# EAGLE design mini1284 (EAGLE 6.4)
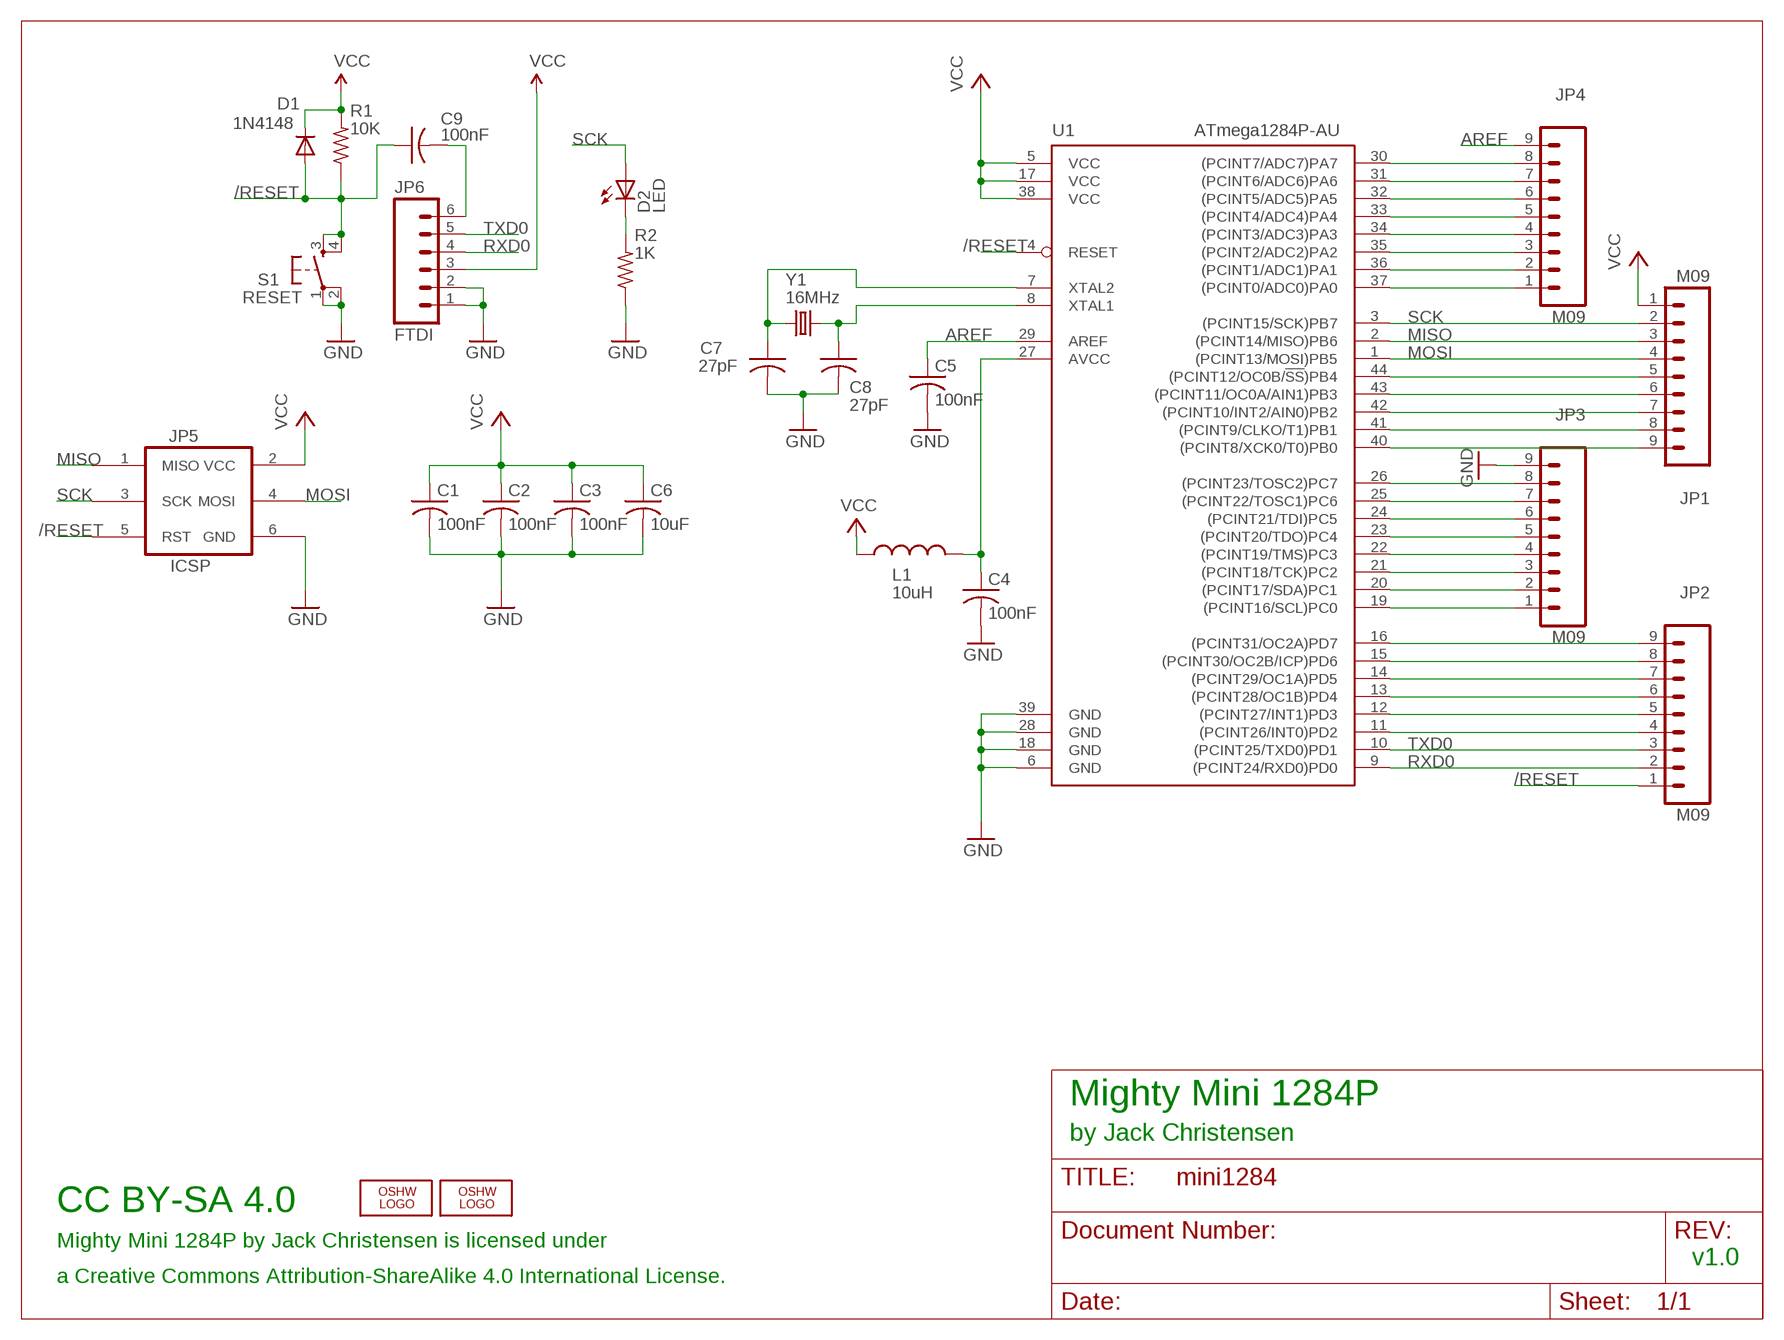
[diagram p0: schematic, sheet 1]

## Parts
C1  100nF  C-USM0805  [M0805]
C2  100nF  C-USM0805  [M0805]
C3  100nF  C-USM0805  [M0805]
C4  100nF  C-USM0805  [M0805]
C5  100nF  C-USM0805  [M0805]
C6  10uF  C-USM1206  [M1206]
C7  27pF  C-USM0805  [M0805]
C8  27pF  C-USM0805  [M0805]
C9  100nF  C-USM0805  [M0805]
D1  1N4148  DIODESOD-323F-A  [SOD-323F-A]
D2  LED  LEDD0805A  [D0805A]
JP1  M09  [1X09]
JP2  M09  [1X09]
JP3  M09  [1X09]
JP4  M09  [1X09]
JP5  ICSP  AVR_SPI_PRG_62X3_LOCK  [2X3_LOCK]
JP6  FTDI  M06LOCK  [1X06_LOCK]
L1  10uH  INDUCTORM0805  [M0805]
LOGO1  OSHW_LOGO_8MILX0150-NT  [OSHW_8X150_NOTEXT]
LOGO2  OSHW_LOGO_6MILX0100-NT  [OSHW_6X100_NOTEXT]
R1  10K  R-US_M0805  [M0805]
R2  1K  R-US_M0805  [M0805]
S1  RESET  10-XXPTS810  [PTS810]
U1  ATmega1284P-AU  ATMEGA644A  [TQFP44]
Y1  16MHz  CRYSTALABM2  [CRYSTAL-ABRACON-ABM2]

## Nets
/RESET: C9.1 D1.A JP2.1 JP5.5(RST) R1.1 S1.3(S) S1.4(S1) U1.4(RESET)
AREF: C5.1 JP4.9 U1.29(AREF)
GND: C1.2 C2.2 C3.2 C4.2 C5.2 C6.2 C7.2 C8.2 JP3.9 JP5.6(GND) JP6.1 JP6.2 R2.1 S1.1(P) S1.2(P1) U1.6(GND) U1.18(GND) U1.28(GND) U1.39(GND)
MISO: JP1.3 JP5.1(MISO) U1.2((PCINT14/MISO)PB6)
MOSI: JP1.4 JP5.4(MOSI) U1.1((PCINT13/MOSI)PB5)
N$1: C4.1 L1.2 U1.27(AVCC)
N$2: C8.1 U1.8(XTAL1) Y1.P$2
N$3: C7.1 U1.7(XTAL2) Y1.P$1
N$7: JP2.4 U1.11((PCINT26/INT0)PD2)
N$8: JP1.5 U1.44((PCINT12/OC0B/!SS!)PB4)
N$9: JP1.6 U1.43((PCINT11/OC0A/AIN1)PB3)
N$10: JP1.7 U1.42((PCINT10/INT2/AIN0)PB2)
N$11: JP1.8 U1.41((PCINT9/CLKO/T1)PB1)
N$12: JP1.9 U1.40((PCINT8/XCK0/T0)PB0)
N$13: JP2.5 U1.12((PCINT27/INT1)PD3)
N$14: JP2.6 U1.13((PCINT28/OC1B)PD4)
N$15: JP2.7 U1.14((PCINT29/OC1A)PD5)
N$16: JP2.8 U1.15((PCINT30/OC2B/ICP)PD6)
N$17: JP2.9 U1.16((PCINT31/OC2A)PD7)
N$18: JP3.1 U1.19((PCINT16/SCL)PC0)
N$19: JP3.2 U1.20((PCINT17/SDA)PC1)
N$20: JP3.3 U1.21((PCINT18/TCK)PC2)
N$21: JP3.4 U1.22((PCINT19/TMS)PC3)
N$22: JP3.5 U1.23((PCINT20/TDO)PC4)
N$23: JP3.6 U1.24((PCINT21/TDI)PC5)
N$24: JP3.7 U1.25((PCINT22/TOSC1)PC6)
N$25: JP3.8 U1.26((PCINT23/TOSC2)PC7)
N$26: JP4.1 U1.37((PCINT0/ADC0)PA0)
N$27: JP4.2 U1.36((PCINT1/ADC1)PA1)
N$28: JP4.3 U1.35((PCINT2/ADC2)PA2)
N$29: JP4.4 U1.34((PCINT3/ADC3)PA3)
N$30: JP4.5 U1.33((PCINT4/ADC4)PA4)
N$31: JP4.6 U1.32((PCINT5/ADC5)PA5)
N$32: JP4.7 U1.31((PCINT6/ADC6)PA6)
N$33: JP4.8 U1.30((PCINT7/ADC7)PA7)
N$34: D2.K(C) R2.2
RST: C9.2 JP6.6
RXD0: JP2.2 JP6.4 U1.9((PCINT24/RXD0)PD0)
SCK: D2.A JP1.2 JP5.3(SCK) U1.3((PCINT15/SCK)PB7)
TXD0: JP2.3 JP6.5 U1.10((PCINT25/TXD0)PD1)
VCC: C1.1 C2.1 C3.1 C6.1 D1.K JP1.1 JP5.2(VCC) JP6.3 L1.1 R1.2 U1.5(VCC) U1.17(VCC) U1.38(VCC)

## Notes on the sheet
- Mighty Mini 1284P
- by Jack Christensen
- CC BY-SA 4.0
- Mighty Mini 1284P by Jack Christensen is licensed under
- v1.0
- a Creative Commons Attribution-ShareAlike 4.0 International License.

## Library data of the parts
C1-C9 = _jc:C-US: CAPACITOR, American symbol
D1 = _jc:DIODE
D2 = _jc:LED: LED OSRAM: - CHIPLED LG R971, LG N971, LY N971, LG Q971, LY Q971, LO R971, LY R971 LH N974, LH R974 LS Q976, LO Q976, LY Q976 LO Q996 - Hyper CHIPLED LW Q18S LB Q993, LB Q99A, LB R99A - SideLED LS A670, LO A670, LY A670, LG A670, LP A670 LB A673, LV A673, LT A673, LW A673 LH A674 LY A675 LS A676, LA A676, LO A676, LY A676, LW A676 LS A679, LY A679, LG A679 - Hyper Micro SIDELED® LS Y876, LA Y876, LO Y876, LY Y876 LT Y87S - SmartLED LW L88C, LW L88S LB L89C, LB L89S, LG L890 LS L89K, LO L89K, LY L89K LS L896, LA L896, LO L896, LY L896 - TOPLED LS T670, LO T670, LY T670, LG T670, LP T670 LSG T670, LSP T670, LSY T670, LOP T670, LYG T670 LG T671, LOG T671, LSG T671 LB T673, LV T673, LT T673, LW T673 LH T674 LS T676, LA T676, LO T676, LY T676, LB T676, LH T676, LSB T676, LW T676 LB T67C, LV T67C, LT T67C, LS T67K, LO T67K, LY T67K, LW E67C LS E67B, LA E67B, LO E67B, LY E67B, LB E67C, LV E67C, LT E67C LW T67C LS T679, LY T679, LG T679 LS T770, LO T770, LY T770, LG T770, LP T770 LB T773, LV T773, LT T773, LW T773 LH T774 LS E675, LA E675, LY E675, LS T675 LS T776, LA T776, LO T776, LY T776, LB T776 LHGB T686 LT T68C, LB T68C - Hyper Mini TOPLED® LB M676 - Mini TOPLED Santana® LG M470 LS M47K, LO M47K, LY M47K Source: http://www.osram.convergy.de/
JP1-JP4 = SparkFun:M09: Header 9 Standard 9-pin 0.1" header. Use with straight break away headers (SKU : PRT-00116), right angle break away headers (PRT-00553), swiss pins (PRT-00743), machine pins (PRT-00117), and female headers (PRT-00115).
JP5 = _jc:AVR_SPI_PRG_6: AVR ISP 6 Pin This is the reduced ISP connector for AVR programming. Common on Arduino. This footprint will take up less PCB space and can be used with a 10-pin to 6-pin adapter such as SKU: BOB-08508
JP6 = SparkFun:M06: Header 6 Standard 6-pin 0.1" header. Use with straight break away headers (SKU : PRT-00116), right angle break away headers (PRT-00553), swiss pins (PRT-00743), machine pins (PRT-00117), and female headers (PRT-00115). Molex polarized connector foot print use with SKU : PRT-08094 with associated crimp pins and housings. NOTES ON THE VARIANTS LOCK and LOCK_LONGPADS... This footprint was designed to help hold the alignment of a through-hole component (i.e. 6-pin header) while soldering it into place. You may notice that each hole has been shifted either up or down by 0.005 of an inch from it's more standard position (which is a perfectly straight line). This slight alteration caused the pins (the squares in the middle) to touch the edges of the holes. Because they are alternating, it causes a "brace" to hold the component in place. 0.005 has proven to be the perfect amount of "off-center" position when using our standard breakaway headers. Although looks a little odd when you look at the bare footprint, once you have a header in there, the alteration is very hard to notice. Also, if you push a header all the way into place, it is covered up entirely on the bottom side. This idea of altering the position of holes to aid alignment will be further integrated into the Sparkfun Library for other footprints. It can help hold any component with 3 or more connection pins.
L1 = _jc:INDUCTOR: Murata #11R472C
LOGO1 = ohw-logo:OSHW_LOGO_8MIL
LOGO2 = ohw-logo:OSHW_LOGO_6MIL
R1 R2 = _jc:R-US_: RESISTOR, American symbol
S1 = _jc:10-XX: OMRON SWITCH
U1 = atmel:ATMEGA644: 8-bit Microcontroller with 64K Bytes In-System Programmable Flash Source: http://www.atmel.com/dyn/resources/prod_documents/doc2593.pdf; MPN: ATMEGA644PV-10AU; OC_FARNELL: 1455123; OC_NEWARK: 58M3748
Y1 = _jc:CRYSTAL

## Board
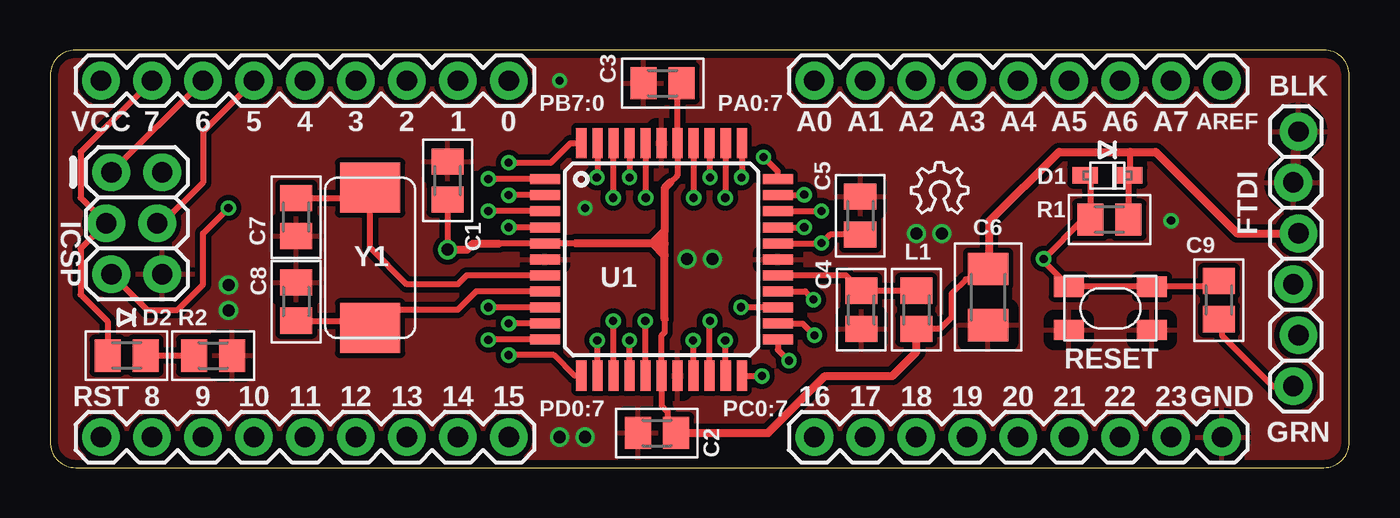
[diagram p1: board, top side]
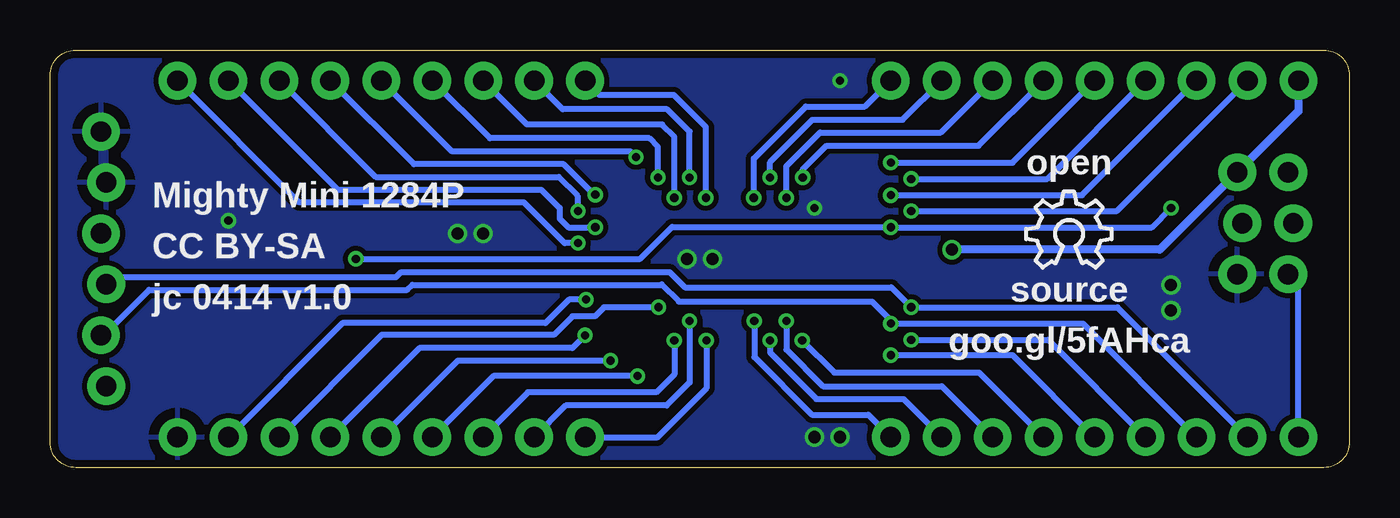
[diagram p2: board, bottom side, seen from below]

Size 64.77 x 20.83 mm. Coordinates in mm from the lower left corner, seen from the top.
Outline: 0,19.56 0,1.27 arc90 1.27,0 63.5,0 arc90 64.77,1.27 64.77,19.56 arc90 63.5,20.83 1.27,20.83 arc90 0,19.56
Copper layers (1*16): Top 0.0356mm / dielectric 1.5011mm / Bottom 0.0356mm
Design rules "LaenPCBOrder_jc1 *": minimum track width 8mil, minimum drill 13mil, track to track 8mil, track to pad 8mil, pad to pad 8mil, via to via 8mil, smd to smd 6mil, copper to edge 15mil, drill to drill 6mil, minimum pad ring 7mil, minimum via ring 7mil, stop-mask expansion 4mil, vias tented up to drill 25mil, thermal gap 20mil

### Footprints (pad centres in the part's own frame; a part is rotated, then mirrored left to right if it is on the bottom)
M0805 = smd 1.3 x 1.6: 1 -0.95,0; 2 0.95,0
M1206 = smd 1.6 x 2: 1 -1.4,0; 2 1.4,0
SOD-323F-A = smd 1.27 x 0.813: A -1.118,0; K 1.118,0
D0805A = smd 1.3 x 1.6: A -0.95,0; K 0.95,0
1X09 = drill 1.016 pad 1.88: 1 0,0; 2 2.54,0; 3 5.08,0; 4 7.62,0; 5 10.16,0; 6 12.7,0; 7 15.24,0; 8 17.78,0; 9 20.32,0
2X3_LOCK = drill 1.016 pad 1.88: 1 0,0; 2 0,2.54; 3 2.54,-0.254; 4 2.54,2.286; 5 5.08,0; 6 5.08,2.54
1X06_LOCK = drill 1.016 pad 1.88: 1 0,0; 2 2.54,-0.254; 3 5.08,0; 4 7.62,-0.254; 5 10.16,0; 6 12.7,-0.254
PTS810 = smd 1.5 x 1: 1 -2.075,1.075; 2 2.075,1.075; 3 -2.075,-1.075; 4 2.075,-1.075
TQFP44 = smd 1.5 x 0.5: 1 -5.8,4; 2 -5.8,3.2; 3 -5.8,2.4; 4 -5.8,1.6; 5 -5.8,0.8; 6 -5.8,0; 7 -5.8,-0.8; 8 -5.8,-1.6; 9 -5.8,-2.4; 10 -5.8,-3.2; 11 -5.8,-4; 23 5.8,-4; 24 5.8,-3.2; 25 5.8,-2.4; 26 5.8,-1.6; 27 5.8,-0.8; 28 5.8,0; 29 5.8,0.8; 30 5.8,1.6; 31 5.8,2.4; 32 5.8,3.2; 33 5.8,4 | smd 0.5 x 1.5: 12 -4,-5.8; 13 -3.2,-5.8; 14 -2.4,-5.8; 15 -1.6,-5.8; 16 -0.8,-5.8; 17 0,-5.8; 18 0.8,-5.8; 19 1.6,-5.8; 20 2.4,-5.8; 21 3.2,-5.8; 22 4,-5.8; 34 4,5.8; 35 3.2,5.8; 36 2.4,5.8; 37 1.6,5.8; 38 0.8,5.8; 39 0,5.8; 40 -0.8,5.8; 41 -1.6,5.8; 42 -2.4,5.8; 43 -3.2,5.8; 44 -4,5.8
CRYSTAL-ABRACON-ABM2 = smd 2.5 x 3: P$1 -3.5,0; P$2 3.5,0

### Placement (x,y rotation side)
C1  19.81,14.33 90 top
C2  30.25,1.73 180 top
C3  30.53,19.18 180 top
C4  40.44,7.87 270 top
C5  40.39,12.57 90 top
C6  46.76,8.51 270 top
C7  12.27,12.5 270 top
C8  12.27,8.28 90 top
C9  58.27,8.36 270 top
D1  52.7,14.58 0 top
D2  3.81,5.59 0 top
JP1  2.54,19.3 0 top
JP2  2.54,1.52 0 top
JP3  38.1,1.52 0 top
JP4  38.1,19.3 0 top
JP5  3.05,14.73 270 top
JP6  62.23,16.76 270 top
L1  43.18,7.87 90 top
LOGO1  16.1,9.98 0 bottom
LOGO2  42.93,12.7 0 top
R1  52.81,12.37 0 top
R2  8.13,5.59 180 top
S1  52.86,7.95 180 top
U1  30.48,10.39 0 top
Y1  15.95,10.46 270 top

### Tracks (layer width: path | path; a pad name or v marks a point on that pad's centre or on a via)
/RESET  (via drill 0.41)
  Top 0.305: U1.4 | C9.1 57.91,9.18 57.76,9.03 S1.3 S1.4 49.53,10.28 v49.53,10.41 51.49,12.37 R1.1 51.86,14.31 D1.A | JP5.5 4.83,7.87 6.35,7.87 7.62,9.14 7.62,11.68 v8.89,12.95 | U1.4 v22.86,11.99
  Bottom 0.305: v8.89,12.95 9.86,11.99 v22.86,11.99 22.89,12.01 33.76,12.01 35.36,10.41 v49.53,10.41 | JP2.1 2.54,9.14 JP5.5
AREF  (via drill 0.41)
  Top 0.305: U1.29 38.44,11.19 v38.46,11.2 38.88,11.62 C5.1
  Bottom 0.305: v38.46,11.2 39.12,11.2 41.15,13.23 52.35,13.23 JP4.9
GND  (via drill 0.41, 0.6)
  other vias: 26.67,1.52 31.75,10.41 8.89,9.12 25.4,1.52 8.89,7.85 33.02,10.41 44.45,11.68 43.18,11.68 25.4,19.3 26.67,12.95 55.88,12.32
  pour Top (isolate 0.254): -2.54,23.11 68.58,23.11 68.58,-2.29 -2.54,-2.29
  pour Bottom (isolate 0.254): -1.27,21.84 67.31,21.84 67.31,-1.02 -1.27,-1.02
MISO  (via drill 0.41)
  Top 0.305: JP1.3 JP5.1 | U1.2 v22.86,13.59 | v22.86,13.59
  Bottom 0.305: v22.86,13.59 13.34,13.59 JP1.3
MOSI  (via drill 0.41)
  Top 0.305: JP1.4 7.62,16.76 7.62,14.22 5.59,12.19 JP5.4 | U1.1 24.67,14.4 v21.84,14.4
  Bottom 0.305: JP1.4 15.06,14.4 v21.84,14.4
N$1
  Top 0.305: L1.2 C4.1 39.67,9.59 U1.27
N$2
  Top 0.305: U1.8 21.23,8.79 20.32,7.87 16.51,7.87 16.51,7.52 Y1.P$2 15.59,7.33 C8.1
N$3
  Top 0.305: U1.7 20.77,9.59 20.32,9.14 17.78,9.14 15.95,10.97 Y1.P$1 15.43,13.45 C7.1
N$7  (via drill 0.41)
  Top 0.305: U1.11 21.86,6.39 v21.84,6.38
  Bottom 0.305: JP2.4 15.01,6.38 v21.84,6.38
N$8  (via drill 0.41)
  Top 0.305: v22.86,15.21 24.97,15.21 25.93,16.18 U1.44
  Bottom 0.305: JP1.5 16.79,15.21 v22.86,15.21
N$9  (via drill 0.41)
  Top 0.305: U1.43 27.28,14.5 v27.25,14.48
  Bottom 0.305: v27.25,14.48 27.25,14.86 26.06,16.05 18.49,16.05 JP1.6
N$10  (via drill 0.41)
  Top 0.305: U1.42 28.07,16.18 v28.07,13.46
  Bottom 0.305: v28.07,13.46 28.07,15.04 26.39,16.71 20.37,16.71 JP1.7
N$11  (via drill 0.41)
  Top 0.305: U1.41 v28.88,14.48 | v28.88,14.48
  Bottom 0.305: v28.88,14.48 28.88,15.24 26.77,17.35 22.28,17.35 JP1.8
N$12  (via drill 0.41)
  Top 0.305: U1.40 v29.68,13.47 v29.69,13.46
  Bottom 0.305: v29.69,13.46 29.69,15.42 27.1,18.01 24.16,18.01 JP1.9
N$13  (via drill 0.41)
  Top 0.305: U1.12 26.14,4.59 25.12,5.61 v22.86,5.61
  Bottom 0.305: JP2.5 16.79,5.61 v22.86,5.61
N$14  (via drill 0.41)
  Top 0.305: U1.13 v27.28,6.35 | v27.28,6.35
  Bottom 0.305: v27.28,6.35 25.68,4.75 18.47,4.75 JP2.6
N$15  (via drill 0.41)
  Top 0.305: U1.14 28.08,7.3 v28.07,7.31
  Bottom 0.305: v28.07,7.31 28.07,5.89 26.24,4.06 20.32,4.06 JP2.7
N$16  (via drill 0.41)
  Top 0.305: U1.15 v28.88,6.35 | v28.88,6.35
  Bottom 0.305: v28.88,6.35 28.88,5.74 26.57,3.43 22.23,3.43 JP2.8
N$17  (via drill 0.41)
  Top 0.305: U1.16 29.68,7.3 v29.67,7.31
  Bottom 0.305: v29.67,7.31 29.67,5.51 26.8,2.64 23.98,2.64 JP2.9
N$18  (via drill 0.41)
  Top 0.305: U1.19 32.08,6.32 v32.05,6.35
  Bottom 0.305: v32.05,6.35 32.05,3.96 34.52,1.5 38.08,1.5 JP3.1
N$19  (via drill 0.41)
  Top 0.305: U1.20 32.88,7.3 v32.89,7.31
  Bottom 0.305: v32.89,7.31 32.89,4.24 34.04,3.1 39.06,3.1 JP3.2
N$20  (via drill 0.41)
  Top 0.305: U1.21 33.68,6.32 v33.66,6.35
  Bottom 0.305: v33.66,6.35 33.66,4.65 34.54,3.76 40.95,3.76 JP3.3
N$21  (via drill 0.41)
  Top 0.305: U1.22 35.47,4.59 v35.48,4.57
  Bottom 0.305: v35.48,4.57 42.67,4.57 JP3.4
N$22  (via drill 0.41)
  Top 0.305: U1.23 36.28,5.88 v36.83,5.33
  Bottom 0.305: v36.83,5.33 44.45,5.33 JP3.5
N$23  (via drill 0.41)
  Top 0.305: U1.24 37.52,7.19 v38.1,6.6
  Bottom 0.305: v38.1,6.6 38.73,5.97 46.35,5.97 JP3.6
N$24  (via drill 0.41)
  Top 0.305: U1.25 34.45,7.99 v34.44,8
  Bottom 0.305: v34.44,8 37.16,8 37.62,7.54 38.73,7.54 39.65,6.63 48.23,6.63 JP3.7
N$25  (via drill 0.41)
  Top 0.305: U1.26 37.64,8.79 v38.05,8.38
  Bottom 0.305: v38.05,8.38 38.91,8.38 40.08,7.21 50.19,7.21 JP3.8
N$26  (via drill 0.41)
  Top 0.305: U1.37 v32.08,13.46 | v32.08,13.46
  Bottom 0.305: v32.08,13.46 32.08,16.99 33.68,18.59 37.39,18.59 JP4.1
N$27  (via drill 0.41)
  Top 0.305: U1.36 32.88,14.49 v32.89,14.48
  Bottom 0.305: v32.89,14.48 32.89,16.76 34.01,17.88 39.22,17.88 JP4.2
N$28  (via drill 0.41)
  Top 0.305: U1.35 33.68,13.49 v33.66,13.46
  Bottom 0.305: v33.66,13.46 33.66,16.51 34.27,17.12 41,17.12 JP4.3
N$29  (via drill 0.41)
  Top 0.305: U1.34 34.48,14.49 v34.47,14.48
  Bottom 0.305: v34.47,14.48 34.47,16 34.9,16.43 42.85,16.43 JP4.4
N$30  (via drill 0.41)
  Top 0.305: U1.33 36.28,14.77 v35.56,15.49
  Bottom 0.305: v35.56,15.49 35.84,15.77 44.73,15.77 JP4.5
N$31  (via drill 0.41)
  Top 0.305: U1.32 37.57,13.59 v37.59,13.61
  Bottom 0.305: JP4.6 46.63,15.14 39.17,15.14 37.64,13.61 v37.59,13.61
N$32  (via drill 0.41)
  Top 0.305: U1.31 38.44,12.79 v38.46,12.8
  Bottom 0.305: JP4.7 48.54,14.5 39.42,14.5 38.48,13.56 38.48,12.83 v38.46,12.8
N$33  (via drill 0.41)
  Top 0.305: U1.30 v37.59,11.99 | v37.59,11.99
  Bottom 0.305: JP4.8 50.44,13.87 40.28,13.87 39.37,12.95 39.37,12.42 38.94,11.99 v37.59,11.99
N$34
  Top 0.305: D2.K R2.2
RST
  Top 0.305: C9.2 58.42,7.25 58.42,6.6 60.96,4.06 JP6.6
RXD0  (via drill 0.41)
  Top 0.305: U1.9 21.86,7.99 v21.84,8
  Bottom 0.305: JP6.4 61.62,9.5 47.52,9.5 47.27,9.75 33.88,9.75 33.12,8.99 22.84,8.99 v21.84,8 11.56,8 JP2.2
SCK  (via drill 0.41)
  Top 0.305: JP1.2 1.52,15.75 1.52,13.46 JP5.3 1.52,10.92 1.52,8.64 2.86,7.3 D2.A | U1.3 21.86,12.79 v21.84,12.8
  Bottom 0.305: v21.84,12.8 11.58,12.8 JP1.2
TXD0  (via drill 0.41)
  Top 0.305: U1.10 v22.86,7.19
  Bottom 0.305: JP2.3 13.28,7.19 v22.86,7.19 22.86,7.34 23.8,8.28 33.43,8.28 34.29,9.14 34.31,9.12 46.71,9.12 46.97,8.87 59.84,8.87 62.1,6.6 JP6.5
VCC  (via drill 0.6)
  Top 0.305: 26.21,11.2 24.69,11.2 U1.5 22.36,11.19 22.35,11.18 | 43.78,6.92 L1.1 44.36,6.92 44.93,7.49 44.93,8.69 45.64,9.4 46.25,9.4 C6.1 46.3,10.37 | C3.1 31.28,18.54 U1.38 31.27,16.18 31.27,14.58 30.91,14.22 | 30.48,4.06 U1.17 30.48,6.6 30.63,6.76 30.63,7.42 | 30.45,4.09 30.48,4.06 | 30.48,4.06 30.48,3.1 30.79,2.79 30.79,2.14 C2.1 | R1.2 53.76,14.51 D1.K 53.85,14.61 53.85,15.75 | C1.1 v19.81,10.87
  Top 0.406: 43.23,6.87 L1.1 43.18,5.77 41.99,4.57 38.63,4.57 35.79,1.73 C2.1 | 46.84,9.98 C6.1 46.81,9.96 46.81,12.27 50.29,15.75 53.85,15.75 55.12,15.75 59.18,11.68 JP6.3 | 30.63,7.42 30.63,10.59 | 30.63,10.59 30.63,11.18 | 30.63,11.18 30.63,11.81 | 26.21,11.2 30.02,11.2 | 30.02,11.2 30.61,11.2 30.63,11.18 | 30.63,11.81 30.02,11.2 | 30.02,11.2 30.63,10.59 | 30.91,14.22 30.63,13.95 30.63,11.81 | v19.81,10.87 20.78,10.87 21.08,11.18 22.35,11.18
  Bottom 0.406: JP1.1 2.54,17.78 JP5.2 9.45,10.87 v19.81,10.87

### Text on the board
tPlace: BLK | PB7:0 | PA0:7 | VCC | 7 | 6 | 5 | 4 | 3 | 2 | 1 | 0 | A0 | A1 | A2 | A3 | A4 | A5 | A6 | A7 | AREF | FTDI | ICSP | RESET | RST | 8 | 9 | 10 | 11 | 12 | 13 | 14 | 15 | 16 | 17 | 18 | 19 | 20 | 21 | 22 | 23 | GND | PD0:7 | PC0:7 | GRN
bPlace: open | Mighty Mini 1284P | CC BY-SA | source | jc 0414 v1.0 | goo.gl/5fAHca